# Altium schematic sheet 04_FAN_DRIVER.SchDoc: Fan Drivers
size A4; Author: Sasa Karanovic; Organization: Altium Limited; Revision: 04; SheetNumber: 4; SheetTotal: 4; PrjDate: 2023-09-29; PrjTime: 23:04; PrjName: OpenFAN Micro
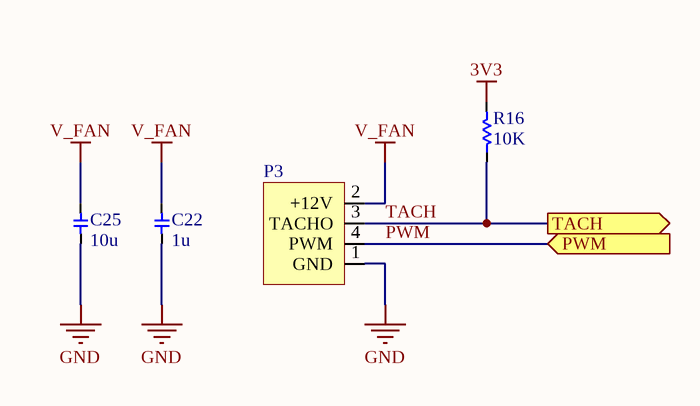
[diagram p0: 04_FAN_DRIVER.SchDoc]

## Parts
C22  value 1u  [0603 - CAP]  (hidden comment: Cap)
C25  value 10u  [0805]  (hidden comment: Cap)
P3  WM4330-ND  [FAN_Connector_4pin]  (value not drawn)
R16  value 10K  [0402]  (hidden comment: Res)

## Ports
PWM (in), TACH (out)

## Nets
3V3: R16.2
GND: C22.1 C25.1 P3.1(GND)
V_FAN: C22.2 C25.2 P3.2(+12V)
PWM: P3.4(PWM) ; port PWM
TACH: P3.3(TACHO) R16.1 ; port TACH

## Notes on the sheet
- Page:
- Drawn By:
- Project:
- Rev:
- Time:
- Date:
- Sheet
- of

## Library data of the parts
C22 = Cap: Capacitor; Manufacturer: YAGEO; Manufacturer Part Number: CC0603KRX7R9BB105; Voltage: 50V; Temp Rating: X7R; Distributor Part Number: C559769; Distributor: LCSC
C25 = Cap: Capacitor; Manufacturer: Samsung Electro-Mechanics; Manufacturer Part Number: CL21B106KOQNNNE; Voltage: 16V; Temp Rating: X7R; Distributor Part Number: C95841; Distributor: LCSC
P3 = Header 4-pin Intel Fan: 4 Positions Header Connector 0.100" (2.54mm) Through Hole Tin; Manufacturer: Molex; Manufacturer Part Number: 0470531000; Distributor: LCSC; Distributor Part Number: C3025061
R16 = Res: Resistor; Manufacturer: YAGEO; Manufacturer Part Number: RC0402FR-0710KL; Distributor: LCSC; Distributor Part Number: C60490